# EAGLE design BDVLS_0V1 (EAGLE 6.4)
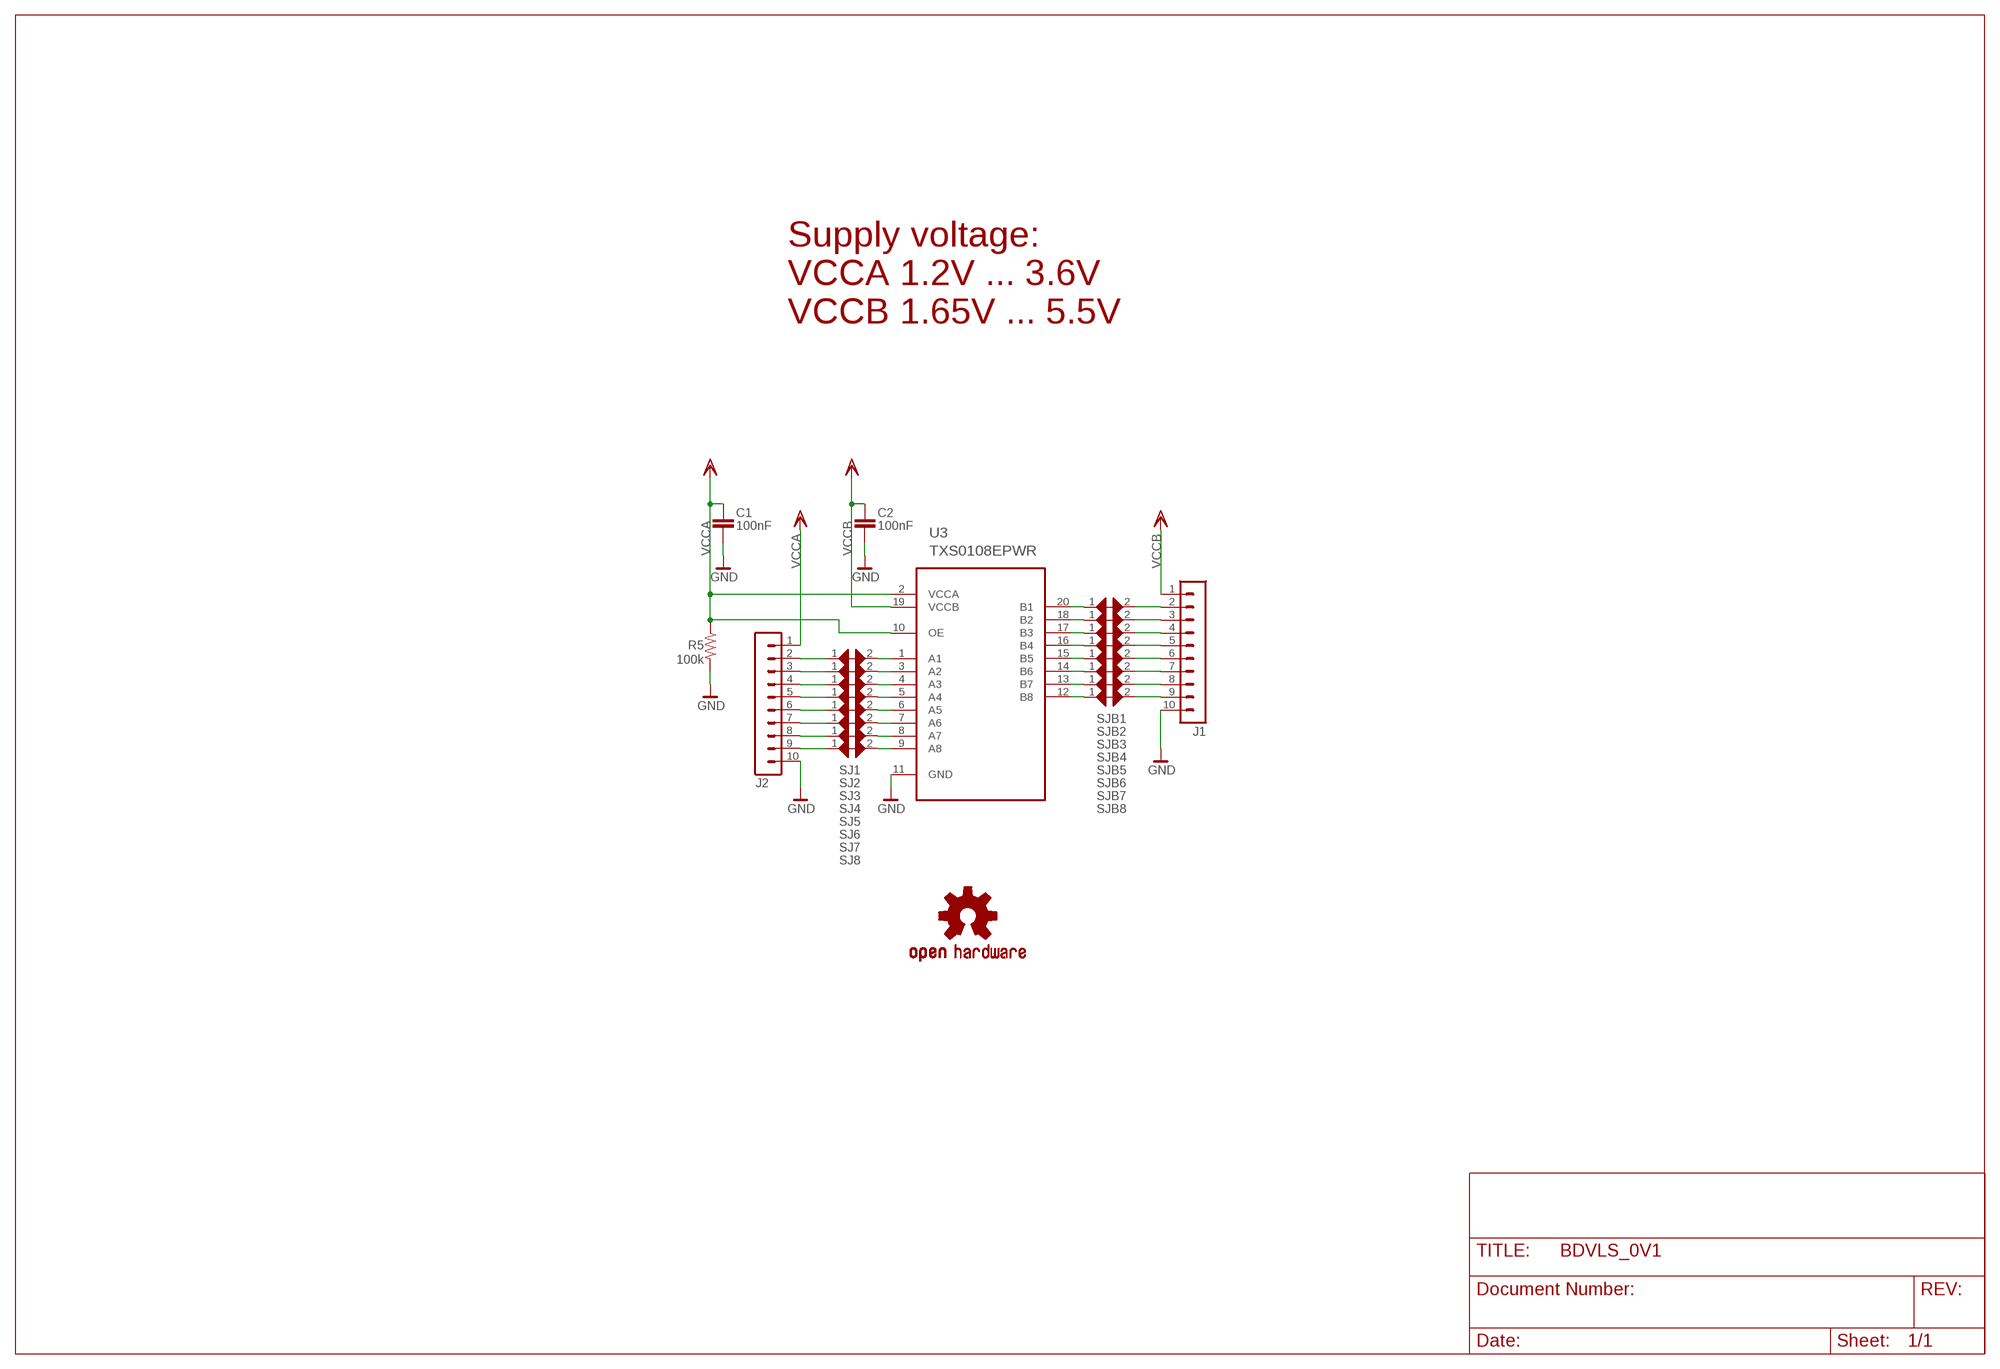
[diagram p0: schematic, sheet 1]

## Parts
C1  100nF  CAP-SMD0603  [0603]
C2  100nF  CAP-SMD0603  [0603]
J1  PIN10S  [PIN10S]
J2  PIN10S  [PIN10S]
R5  100k  R-US_R0402  [R0402]
SJ1  printed  JUMPER_SMD_MICRO_SHORT  [JUMPER_SMD_MICRO_SHORT]
SJ2  printed  JUMPER_SMD_MICRO_SHORT  [JUMPER_SMD_MICRO_SHORT]
SJ3  printed  JUMPER_SMD_MICRO_SHORT  [JUMPER_SMD_MICRO_SHORT]
SJ4  printed  JUMPER_SMD_MICRO_SHORT  [JUMPER_SMD_MICRO_SHORT]
SJ5  printed  JUMPER_SMD_MICRO_SHORT  [JUMPER_SMD_MICRO_SHORT]
SJ6  printed  JUMPER_SMD_MICRO_SHORT  [JUMPER_SMD_MICRO_SHORT]
SJ7  printed  JUMPER_SMD_MICRO_SHORT  [JUMPER_SMD_MICRO_SHORT]
SJ8  printed  JUMPER_SMD_MICRO_SHORT  [JUMPER_SMD_MICRO_SHORT]
SJB1  printed  JUMPER_SMD_MICRO_SHORT  [JUMPER_SMD_MICRO_SHORT]
SJB2  printed  JUMPER_SMD_MICRO_SHORT  [JUMPER_SMD_MICRO_SHORT]
SJB3  printed  JUMPER_SMD_MICRO_SHORT  [JUMPER_SMD_MICRO_SHORT]
SJB4  printed  JUMPER_SMD_MICRO_SHORT  [JUMPER_SMD_MICRO_SHORT]
SJB5  printed  JUMPER_SMD_MICRO_SHORT  [JUMPER_SMD_MICRO_SHORT]
SJB6  printed  JUMPER_SMD_MICRO_SHORT  [JUMPER_SMD_MICRO_SHORT]
SJB7  printed  JUMPER_SMD_MICRO_SHORT  [JUMPER_SMD_MICRO_SHORT]
SJB8  printed  JUMPER_SMD_MICRO_SHORT  [JUMPER_SMD_MICRO_SHORT]
U3  TXS0108EPWR  TXB0108PWR  [SOP65P640X120-20N]
U$11  OSHW-LOGOM  [OSHW-LOGO-M]

## Nets
A1: J2.2 SJ1.1
A2: J2.3 SJ2.1
A3: J2.4 SJ3.1
A4: J2.5 SJ4.1
A5: J2.6 SJ5.1
A6: J2.7 SJ6.1
A7: J2.8 SJ7.1
A8: J2.9 SJ8.1
B1: J1.2 SJB1.2
B2: J1.3 SJB2.2
B3: J1.4 SJB3.2
B4: J1.5 SJB4.2
B5: J1.6 SJB5.2
B6: J1.7 SJB6.2
B7: J1.8 SJB7.2
B8: J1.9 SJB8.2
GND: C1.1 C2.1 J1.10 J2.10 R5.2 U3.11(GND)
N$2: SJ1.2 U3.1(A1)
N$3: SJ2.2 U3.3(A2)
N$4: SJ3.2 U3.4(A3)
N$5: SJ4.2 U3.5(A4)
N$10: SJ5.2 U3.6(A5)
N$12: SJ6.2 U3.7(A6)
N$13: SJ7.2 U3.8(A7)
N$14: SJ8.2 U3.9(A8)
N$19: SJB1.1 U3.20(B1)
N$20: SJB2.1 U3.18(B2)
N$21: SJB3.1 U3.17(B3)
N$22: SJB4.1 U3.16(B4)
N$23: SJB5.1 U3.15(B5)
N$24: SJB6.1 U3.14(B6)
N$25: SJB7.1 U3.13(B7)
N$26: SJB8.1 U3.12(B8)
VCCA: C1.2 J2.1 R5.1 U3.2(VCCA) U3.10(OE)
VCCB: C2.2 J1.1 U3.19(VCCB)

## Notes on the sheet
- Supply voltage:
  VCCA 1.2V ... 3.6V
  VCCB 1.65V ... 5.5V

## Library data of the parts
C1 C2 = lve_modositott:CAP-SMD
J1 J2 = dzo:PIN10S
R5 = resistor:R-US_: RESISTOR, American symbol
SJ1-SJ8 SJB1-SJB8 = dzo:JUMPER_SMD_MICRO_SHORT
U3 = dzo:TXB0108PWR: 8-BIT BIDIRECTIONAL VOLTAGE-LEVEL TRANSLATOR; PACKAGE: TSSOP-20; SUPPLIER: Texas Instruments
U$11 = dzo:OSHW-LOGO: Open Source Hardware Logo This logo indicates the piece of hardware it is found on incorporates a OSHW license and/or adheres to the definition of open source hardware found here: http://freedomdefined.org/OSHW

## Board
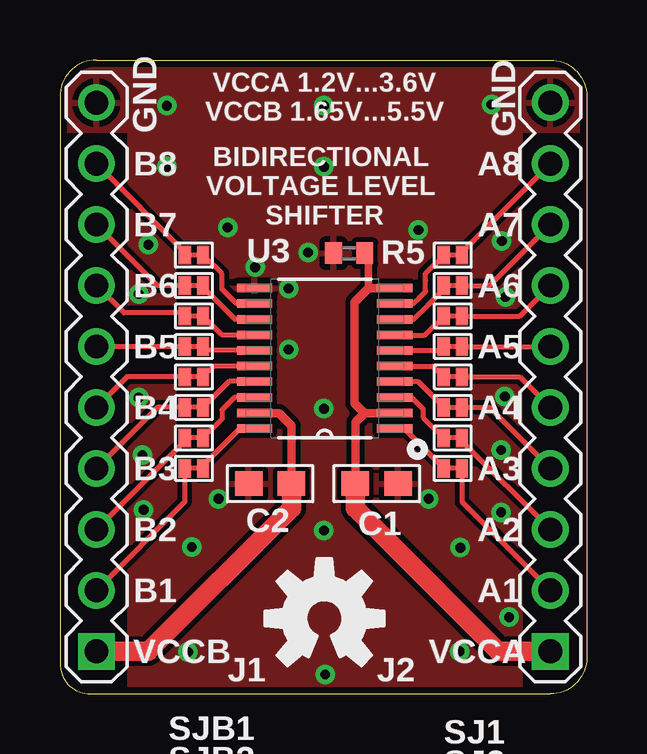
[diagram p1: board, top side]
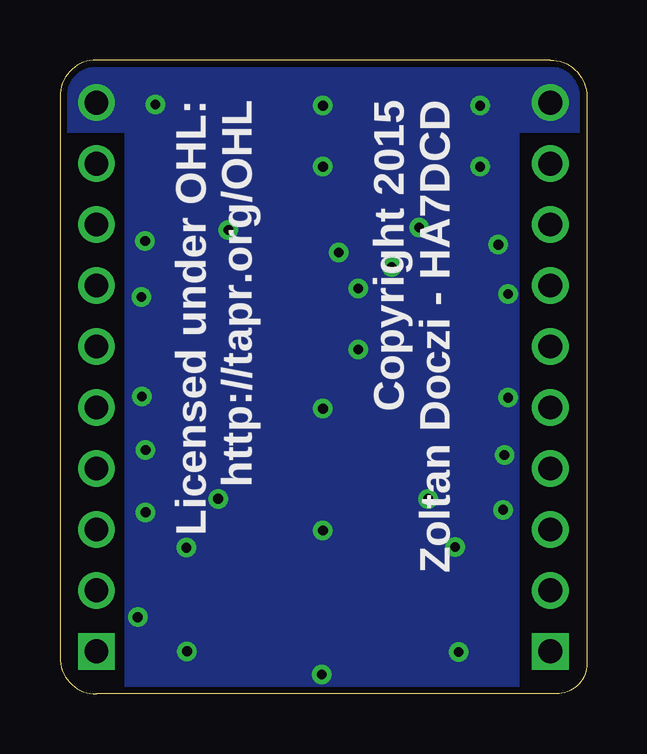
[diagram p2: board, bottom side, seen from below]

Size 21.97 x 26.42 mm. Coordinates in mm from the lower left corner, seen from the top.
Outline: 1.52,26.42 20.45,26.42 arc-90 21.97,24.89 21.97,1.52 arc-90 20.45,0 1.27,0 arc-90 0,1.27 0,24.89 arc-90 1.52,26.42
Copper layers (1*16): Top 0.0356mm / dielectric 1.5mm / Bottom 0.0356mm
Design rules "default_INTEGRATION *": minimum track width 6mil, minimum drill 16mil, track to track 8mil, track to pad 6mil, pad to pad 6mil, via to via 8mil, smd to smd 0mil, copper to edge 10mil, drill to drill 8mil, minimum pad ring 7mil, minimum via ring 8mil, stop-mask expansion 0mil, vias tented up to drill 24mil, thermal gap 10mil
tRestrict: area 0,0.3 to 2.8,23.4; area 19.3,0.3 to 22.1,23.4
bRestrict: area 0,0.3 to 2.8,23.4; area 19.3,0.3 to 22.1,23.4

### Footprints (pad centres in the part's own frame; a part is rotated, then mirrored left to right if it is on the bottom)
0603 = smd 1.143 x 1.016: 1 -0.889,0; 2 0.889,0
PIN10S = drill 0.991 pad 1.524 square: 1 -11.43,0 | drill 0.991 pad 1.524: 2 -8.89,0; 3 -6.35,0; 4 -3.81,0; 5 -1.27,0; 6 1.27,0; 7 3.81,0; 8 6.35,0; 9 8.89,0; 10 11.43,0
R0402 = smd 0.7 x 0.9: 1 -0.65,0; 2 0.65,0
JUMPER_SMD_MICRO_SHORT = smd 0.508 x 0.762: 1 -0.381,0; 2 0.381,0
SOP65P640X120-20N = smd 1.473 x 0.356: 1 -2.921,2.921; 2 -2.921,2.286; 3 -2.921,1.626; 4 -2.921,0.965; 5 -2.921,0.33; 6 -2.921,-0.33; 7 -2.921,-0.965; 8 -2.921,-1.626; 9 -2.921,-2.286; 10 -2.921,-2.921; 11 2.921,-2.921; 12 2.921,-2.286; 13 2.921,-1.626; 14 2.921,-0.965; 15 2.921,-0.33; 16 2.921,0.33; 17 2.921,0.965; 18 2.921,1.626; 19 2.921,2.286; 20 2.921,2.921

### Placement (x,y rotation side)
C1  13.21,8.76 180 top
C2  8.76,8.76 0 top
J1  1.52,13.21 90 top
J2  20.45,13.21 90 top
R5  12.05,18.37 180 top
SJ1  16.38,9.4 180 top
SJ2  16.38,10.67 180 top
SJ3  16.38,11.94 0 top
SJ4  16.38,13.21 180 top
SJ5  16.38,14.48 180 top
SJ6  16.38,15.75 180 top
SJ7  16.38,17.02 180 top
SJ8  16.38,18.29 180 top
SJB1  5.59,9.4 180 top
SJB2  5.59,10.67 180 top
SJB3  5.59,11.94 180 top
SJB4  5.59,13.21 180 top
SJB5  5.59,14.48 180 top
SJB6  5.59,15.75 180 top
SJB7  5.59,17.02 180 top
SJB8  5.59,18.29 180 top
U3  11.04,13.99 180 top
U$11  11.02,3.15 0 top

### Tracks (layer width: path | path; a pad name or v marks a point on that pad's centre or on a via)
A1
  Top 0.203: SJ1.1 16.76,8 J2.2
A2
  Top 0.203: SJ2.1 16.76,10.54 J2.3
A3
  Top 0.203: 16.76,11.94 17.91,11.94 J2.4
A4
  Top 0.203: SJ4.1 19.18,13.21 J2.5
A5
  Top 0.203: SJ5.1 J2.6
A6
  Top 0.203: SJ6.1 19.18,15.75 J2.7
A7
  Top 0.203: SJ7.1 17.91,17.02 J2.8
A8
  Top 0.203: SJ8.1 16.76,18.41 J2.9
B1
  Top 0.203: SJB1.2 5.21,8 J1.2
B2
  Top 0.203: SJB2.2 5.21,10.54 J1.3
B3
  Top 0.203: SJB3.2 4.06,11.94 J1.4
B4
  Top 0.203: SJB4.2 2.79,13.21 J1.5
B5
  Top 0.203: SJB5.2 J1.6
B6
  Top 0.203: SJB6.2 5.21,15.88 2.67,15.88 J1.7
B7
  Top 0.203: SJB7.2 4.06,17.02 J1.8
B8
  Top 0.203: SJB8.2 5.21,18.41 J1.9
GND  (via drill 0.41)
  other vias: 9.53,16.89 10.35,18.39 6.61,8.13 15.38,8.13 8.14,17.78 9.53,14.35 11.01,11.89 11.01,6.81 5.34,1.75 16.67,1.78 16.7,6.1 5.5,6.12 18.73,3.2 4.45,24.51 11.01,24.51 4.45,21.97 11.01,21.97 17.99,24.56 6.99,19.43 3.69,18.72 3.29,16.66 3.29,12.35 3.44,9.96 3.49,7.67 18.42,18.87 18.58,16.54 18.4,10.16 18.55,12.4 18.4,7.57 14.94,19.33 11.06,0.81
  pour Bottom (rank 2, no thermals): 21.97,24.89 21.97,1.52 arc-90 20.19,0 1.27,0 arc-90 0,1.52 0,24.89 arc-90 1.52,26.42 20.45,26.42 arc-90
  pour Top (rank 2): 21.97,24.89 21.97,1.52 arc-90 20.19,0 1.27,0 arc-90 0,1.52 0,24.89 arc-90 1.52,26.42 20.45,26.42 arc-90
N$2
  Top 0.203: U3.1 14.33,11.07 SJ1.2
N$3
  Top 0.203: U3.3 14.66,12.36 15.14,11.89 15.14,11.53 SJ2.2
N$4
  Top 0.203: U3.4 14.92,13.02 16,11.94
N$5
  Top 0.203: U3.5 15.55,13.66 SJ4.2
N$10
  Top 0.203: U3.6 15.84,14.32 SJ5.2
N$12
  Top 0.203: U3.7 15.21,14.95 SJ6.2
N$13
  Top 0.203: U3.8 14.75,15.61 15.34,16.2 16,16.87 SJ7.2
N$14
  Top 0.203: U3.9 14.75,16.27 14.99,16.51 15.24,16.76 15.24,17.22 15.24,17.53 SJ8.2
N$19
  Top 0.203: U3.20 7.51,11.07 7.11,10.67 5.97,9.53 SJB1.1
N$20
  Top 0.203: U3.18 7.28,12.36 6.76,11.84 6.76,11.46 SJB2.1
N$21
  Top 0.203: U3.17 7.05,13.02 SJB3.1
N$22
  Top 0.203: U3.16 6.42,13.66 SJB4.1
N$23
  Top 0.203: U3.15 6.13,14.32 SJB5.1
N$24
  Top 0.203: U3.14 6.76,14.95 SJB6.1
N$25
  Top 0.203: U3.13 7.3,15.61 6.81,16.1 5.97,16.94 SJB7.1
N$26
  Top 0.203: U3.12 7.35,16.27 7.16,16.46 6.76,16.87 6.76,17.27 6.76,17.5 SJB8.1
VCCA
  Top 0.203: U3.2 12.83,11.7 12.7,11.7 12.68,11.7
  Top 0.305: R5.1 arc-90 12.86,18.21 12.86,16.91
  Top 0.356: U3.2 12.7,11.7 | 12.7,11.7 12.28,12.12 12.28,14.41 12.28,16.33 12.86,16.91 U3.10 | 12.7,11.7 12.32,11.32 C1.2
  Top 0.813: J2.1 18.29,1.78 12.32,7.75 C1.2
VCCB
  Top 0.356: U3.19 9.13,11.7 9.65,11.18 C2.2
  Top 0.813: J1.1 3.68,1.78 9.65,7.75 C2.2

### Text on the board
Top: TOP
Bottom: BOTTOM
tPlace: VCCA 1.2V...3.6V / VCCB 1.65V...5.5V | GND | GND | B8 | A8 | BIDIRECTIONAL / VOLTAGE LEVEL / SHIFTER | B7 | A7 | B6 | A6 | B5 | A5 | B4 | A4 | B3 | A3 | B2 | A2 | B1 | A1 | VCCB | VCCA
bPlace: Copyright 2015 / Zoltan Doczi - HA7DCD | Licensed under OHL: / http://tapr.org/OHL